# EAGLE design main (EAGLE 8.2.1)
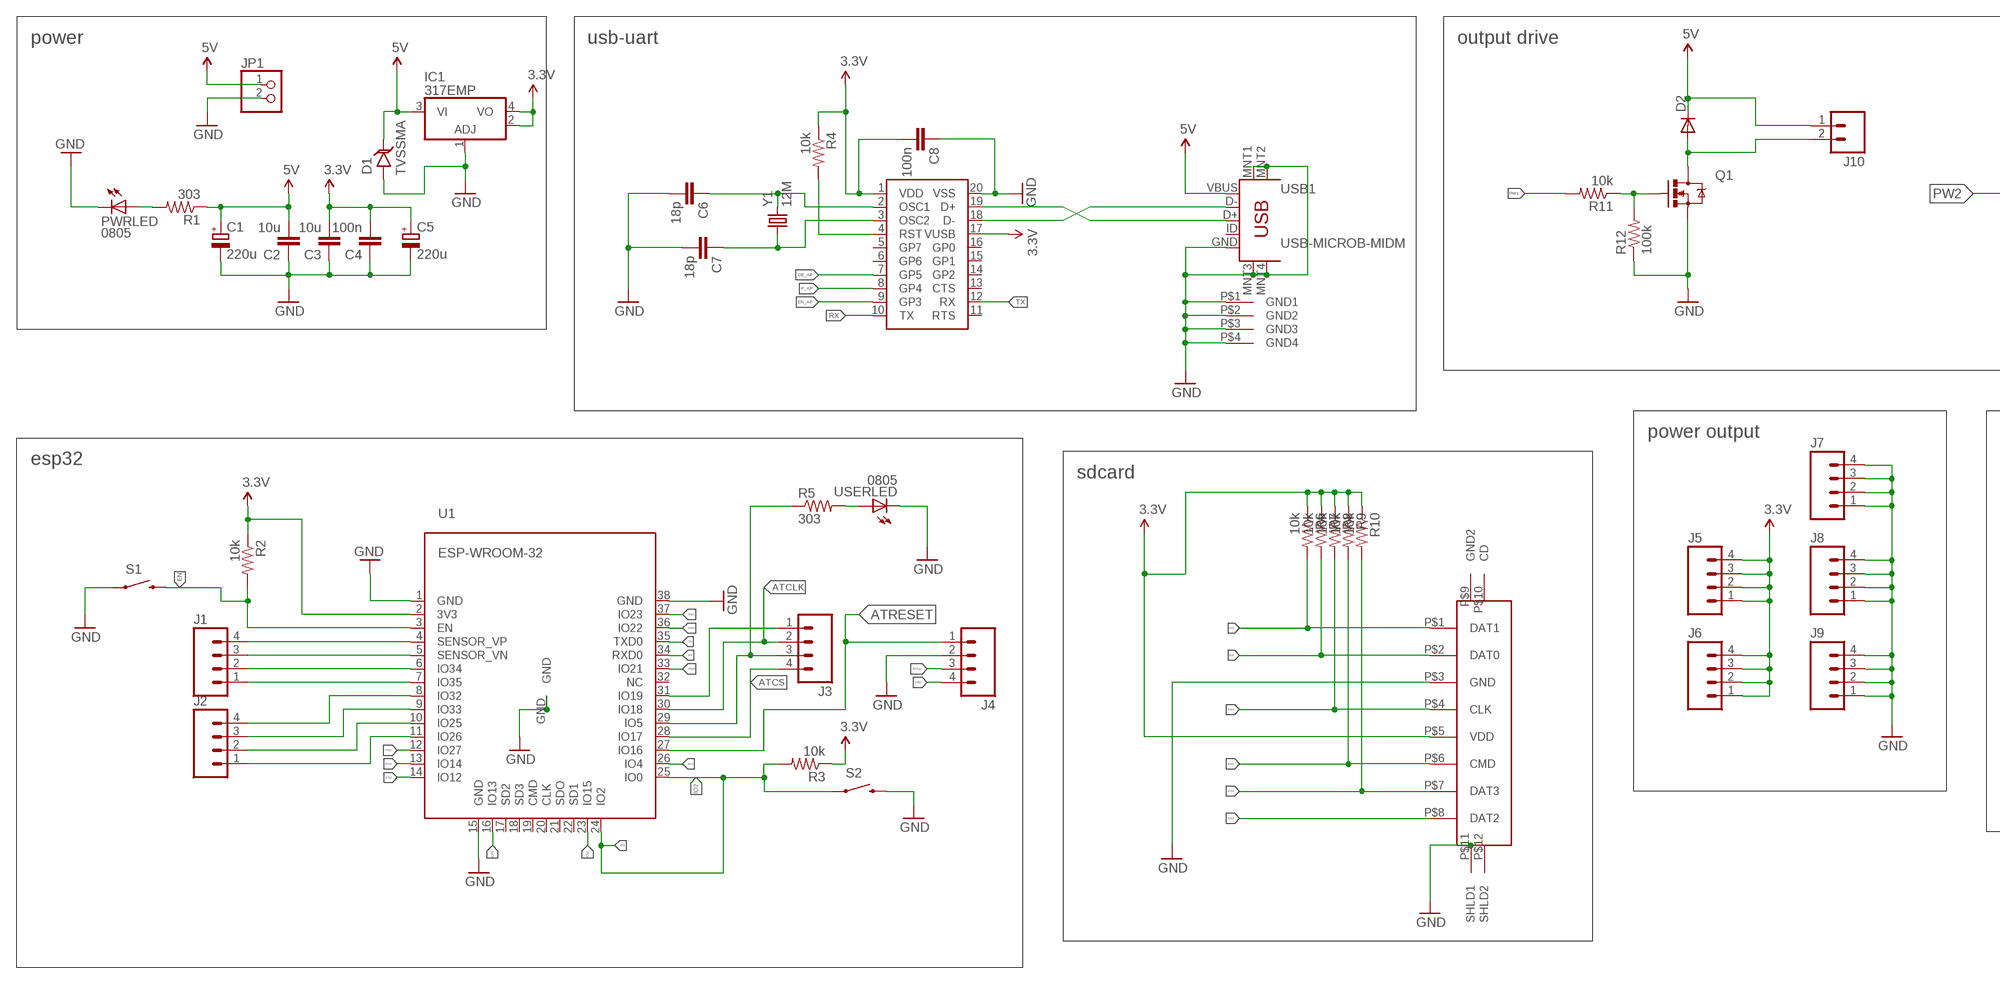
[diagram p0: schematic, sheet 1, part 1 of 2]
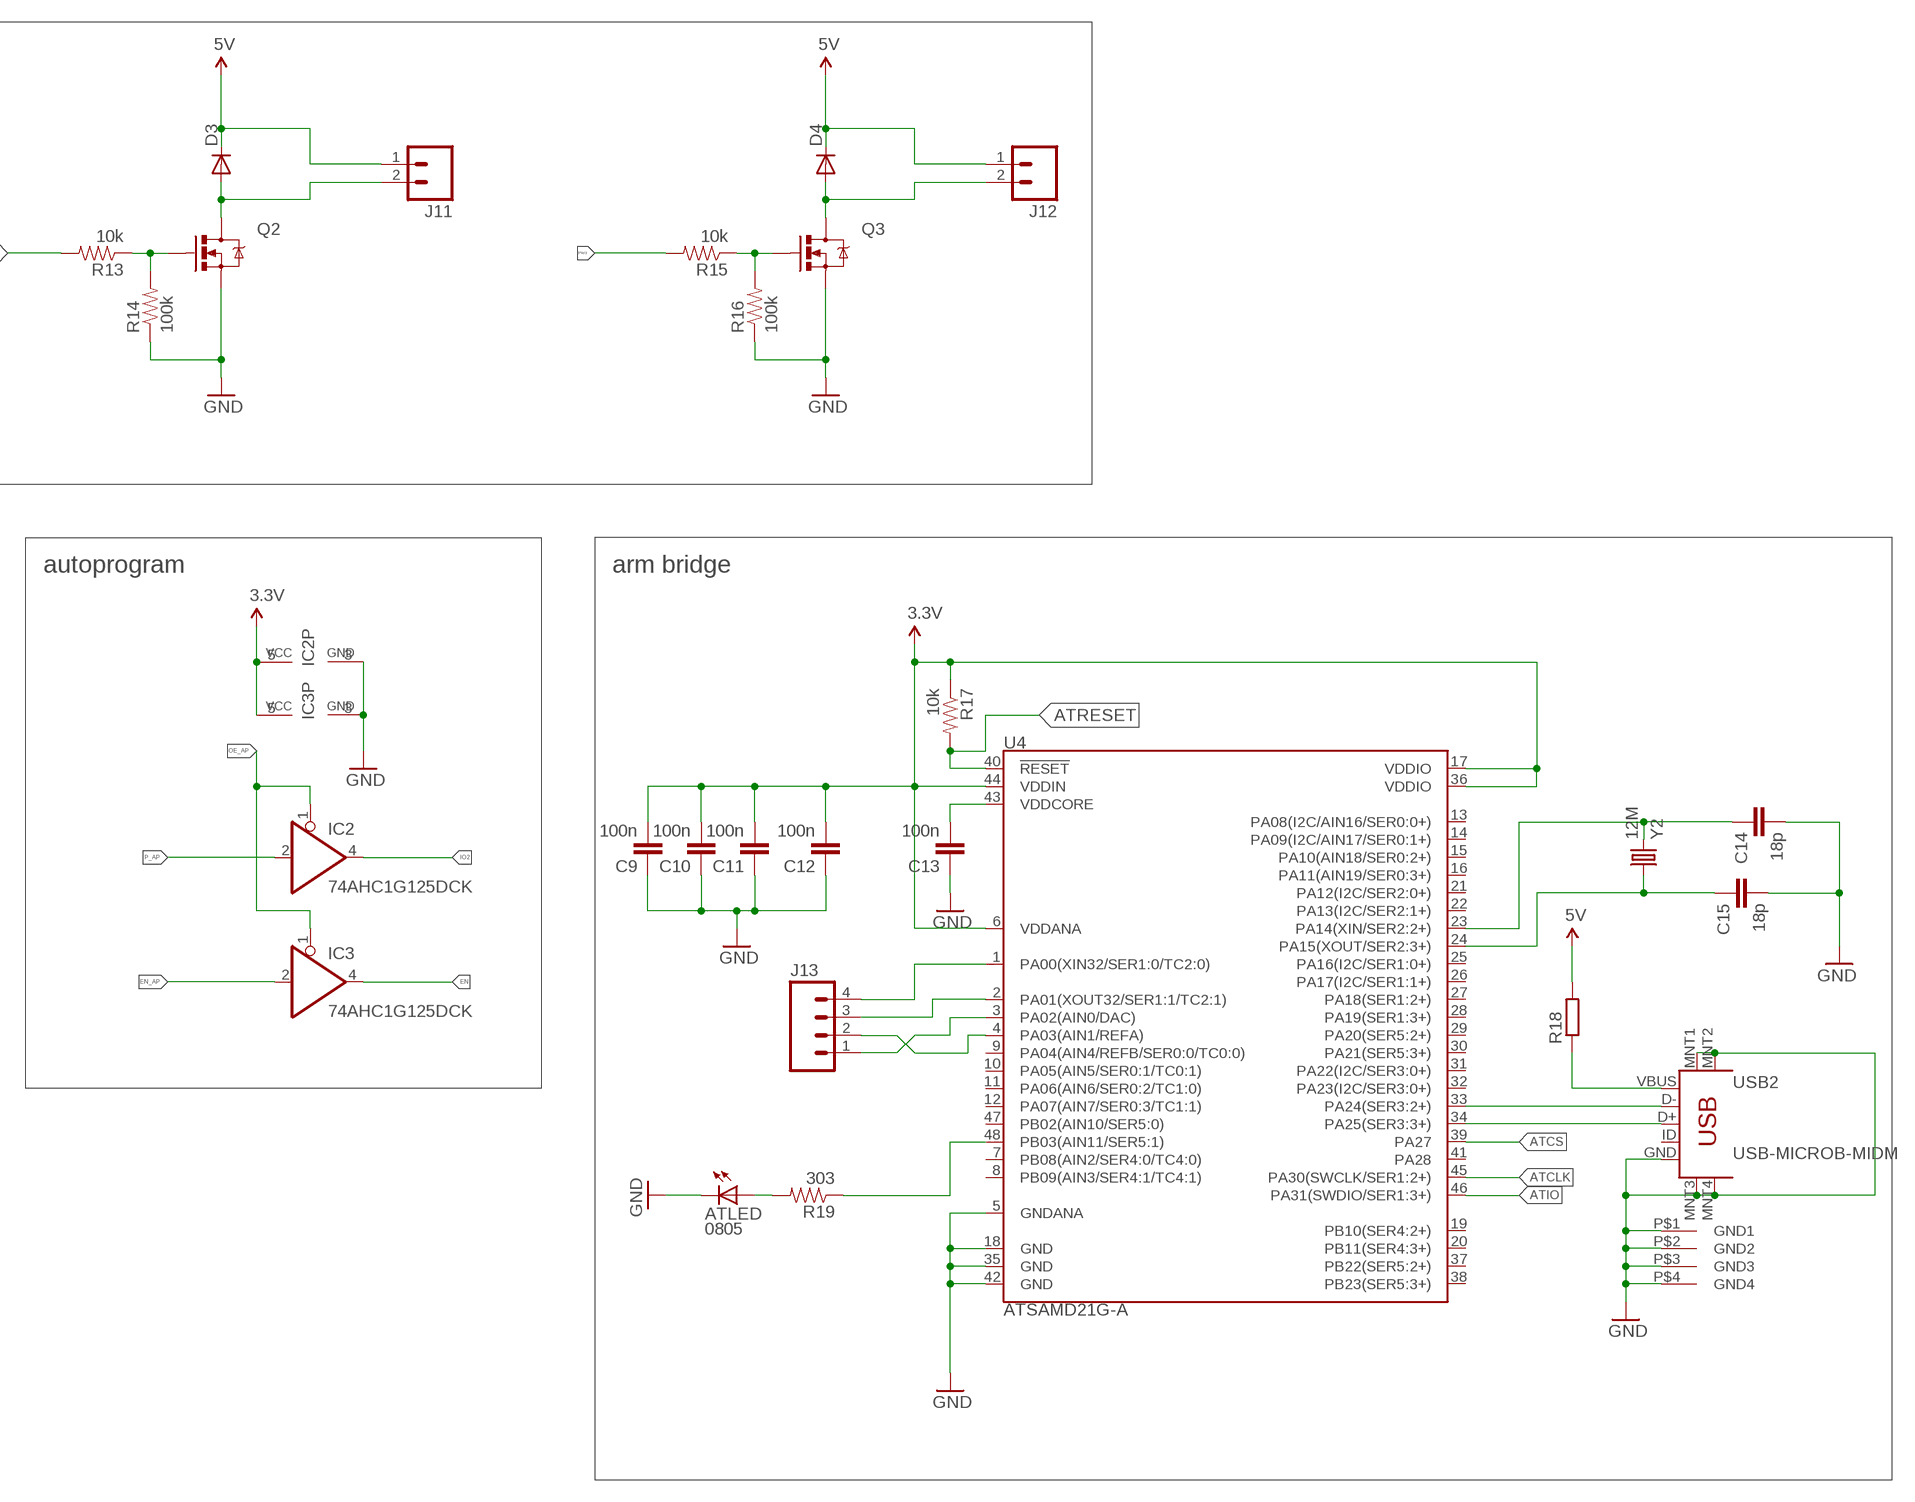
[diagram p1: schematic, sheet 1, part 2 of 2]

## Parts
ATLED  0805  LEDSML0805  [SML0805]
C1  220u  CPOL-EUE2-4  [E2-4]
C2  10u  CAP0805  [0805]
C3  10u  CAP0805  [0805]
C4  100n  CAP0603-CAP  [0603-CAP]
C5  220u  CPOL-EUE2-4  [E2-4]
C6  18p  CAP0603-CAP  [0603-CAP]
C7  18p  CAP0603-CAP  [0603-CAP]
C8  100n  CAP0603-CAP  [0603-CAP]
C9  100n  C-EUC0603K  [C0603K]
C10  100n  C-EUC0603K  [C0603K]
C11  100n  C-EUC0603K  [C0603K]
C12  100n  C-EUC0603K  [C0603K]
C13  100n  C-EUC0603K  [C0603K]
C14  18p  CAP0603-CAP  [0603-CAP]
C15  18p  CAP0603-CAP  [0603-CAP]
D1  TVSSMA  [SMA-DIODE]
D2  DIODE-SOD323-W  [SOD323-W]
D3  DIODE-SOD323-W  [SOD323-W]
D4  DIODE-SOD323-W  [SOD323-W]
IC1  317EMP  [SOT223]
IC2  74AHC1G125DCK  [SC70-5]
IC3  74AHC1G125DCK  [SC70-5]
J1  M04LONGPADS  [1X04_LONGPADS]
J2  M04LONGPADS  [1X04_LONGPADS]
J3  M041.27MM  [1X04-1.27MM]
J4  M041.27MM  [1X04-1.27MM]
J5  M04LONGPADS  [1X04_LONGPADS]
J6  M04LONGPADS  [1X04_LONGPADS]
J7  M04LONGPADS  [1X04_LONGPADS]
J8  M04LONGPADS  [1X04_LONGPADS]
J9  M04LONGPADS  [1X04_LONGPADS]
J10  M02LOCK_LONGPADS  [1X02_LOCK_LONGPADS]
J11  M02LOCK_LONGPADS  [1X02_LOCK_LONGPADS]
J12  M02LOCK_LONGPADS  [1X02_LOCK_LONGPADS]
J13  M041.27MM  [1X04-1.27MM]
JP1  PINHD-1X2  [1X02]
PWRLED  0805  LEDSML0805  [SML0805]
Q1  MOSFET-NCHANNELBSS138  [SOT23-3]
Q2  MOSFET-NCHANNELBSS138  [SOT23-3]
Q3  MOSFET-NCHANNELBSS138  [SOT23-3]
R1  303  RESISTOR0805-RES  [0805]
R2  10k  RESISTOR0805-RES  [0805]
R3  10k  RESISTOR0805-RES  [0805]
R4  10k  RESISTOR0805-RES  [0805]
R5  303  RESISTOR0805-RES  [0805]
R6  10k  RESISTOR0805-RES  [0805]
R7  10k  RESISTOR0805-RES  [0805]
R8  10k  RESISTOR0805-RES  [0805]
R9  10k  RESISTOR0805-RES  [0805]
R10  10k  RESISTOR0805-RES  [0805]
R11  10k  RESISTOR0805-RES  [0805]
R12  100k  RESISTOR0805-RES  [0805]
R13  10k  RESISTOR0805-RES  [0805]
R14  100k  RESISTOR0805-RES  [0805]
R15  10k  RESISTOR0805-RES  [0805]
R16  100k  RESISTOR0805-RES  [0805]
R17  10k  RESISTOR0805-RES  [0805]
R18  R-EU_R2010W  [R2010W]
R19  303  RESISTOR0805-RES  [0805]
S1  SWITCH-MOMENTARY-2SMD  [TACTILE-SWITCH-SMD]
S2  SWITCH-MOMENTARY-2SMD  [TACTILE-SWITCH-SMD]
U1  ESP-WROOM-32  [ESP-WROOM-32]
U2  MCP2200  [SO20W]
U3  MICROSD  [MICROSD]
U4  ATSAMD21G-A  [TQFP-48]
USB1  USB-MICROB-MIDM  [USB-B-MICRO-MIDM]
USB2  USB-MICROB-MIDM  [USB-B-MICRO-MIDM]
USERLED  0805  LEDSML0805  [SML0805]
Y1  12M  CRYSTALTXC-7A  [CRYSTAL-TXC-7A]
Y2  12M  CRYSTALTXC-7A  [CRYSTAL-TXC-7A]

## Nets
3.3V [power]: C3.2 C4.2 C5.+ C8.2 C9.2 C10.2 C11.2 C12.2 IC1.2(VO2) IC1.4(VO) IC2.5(VCC) IC3.5(VCC) J5.1 J5.2 J5.3 J5.4 J6.1 J6.2 J6.3 J6.4 R2.1 R3.1 R4.1 R6.1 R7.1 R8.1 R9.1 R10.1 R17.1 U1.2(3V3) U2.1(VDD) U2.17(VUSB) U3.P$5(VDD) U4.6(VDDANA) U4.17(VDDIO) U4.36(VDDIO) U4.44(VDDIN)
5V [power]: C1.+ C2.2 D1.C D2.C D3.C D4.C IC1.3(VI) J10.1 J11.1 J12.1 JP1.1 R1.1 R18.2 USB1.VBUS
ATCLK: J3.2 J4.3 U1.30(IO18) U4.45(PA30(SWCLK/SER1:2+))
ATCS: J3.4 U1.28(IO17) U4.39(PA27)
ATIO: J4.4 U1.12(IO27) U4.46(PA31(SWDIO/SER1:3+))
ATRESET: J4.1 R17.2 U1.27(IO16) U4.40(!RESET!)
D+: U2.19(D+) USB1.D+
D-: U2.18(D-) USB1.D-
EN: IC3.4(O) R2.2 S1.3 U1.3(EN)
EN_AP: IC3.2(I) U2.9(GP3)
GND [power]: ATLED.C C1.- C2.1 C3.1 C4.1 C5.- C6.2 C7.2 C8.1 C9.1 C10.1 C11.1 C12.1 C13.1 C14.2 C15.2 D1.A IC1.1(ADJ) IC2.3(GND) IC3.3(GND) J4.2 J7.1 J7.2 J7.3 J7.4 J8.1 J8.2 J8.3 J8.4 J9.1 J9.2 J9.3 J9.4 JP1.2 PWRLED.C Q1.2(S) Q2.2(S) Q3.2(S) R12.1 R14.1 R16.1 S1.1 S2.3 U1.1(GND) U1.15(GND) U1.38(GND) U1.GND U2.20(VSS) U3.P$3(GND) U3.P$11(SHLD1) U3.P$12(SHLD2) U4.5(GNDANA) U4.18(GND) U4.35(GND) U4.42(GND) USB1.GND USB1.MNT1(MTN1) USB1.MNT2(MTN2) USB1.MNT3(MTN3) USB1.MNT4(MTN4) USB1.P$1(GND1) USB1.P$2(GND2) USB1.P$3(GND3) USB1.P$4(GND4) USB2.GND USB2.MNT1(MTN1) USB2.MNT2(MTN2) USB2.MNT3(MTN3) USB2.MNT4(MTN4) USB2.P$1(GND1) USB2.P$2(GND2) USB2.P$3(GND3) USB2.P$4(GND4) USERLED.C
IO2: IC2.4(O) R3.2 R7.2 S2.1 U1.24(IO2) U1.25(IO0) U3.P$2(DAT0)
IO4: R6.2 U1.26(IO4) U3.P$1(DAT1)
IO12: U1.14(IO12) U3.P$8(DAT2)
IO13: R10.2 U1.16(IO13) U3.P$7(DAT3)
IO14: R8.2 U1.13(IO14) U3.P$4(CLK)
IO15: R9.2 U1.23(IO15) U3.P$6(CMD)
N$1: J3.1 U1.31(IO19)
N$2: R19.1 U4.48(PB03(AIN11/SER5:1))
N$3: R5.2 USERLED.A
N$4: ATLED.A R19.2
N$5: J3.3 R5.1 U1.29(IO5)
N$6: J13.4 U4.1(PA00(XIN32/SER1:0/TC2:0))
N$7: PWRLED.A R1.2
N$8: J13.3 U4.2(PA01(XOUT32/SER1:1/TC2:1))
N$9: C13.2 U4.43(VDDCORE)
N$10: U4.33(PA24(SER3:2+)) USB2.D-
N$11: U4.34(PA25(SER3:3+)) USB2.D+
N$12: R18.1 USB2.VBUS
N$13: J13.1 U4.3(PA02(AIN0/DAC))
N$14: J13.2 U4.4(PA03(AIN1/REFA))
N$15: D2.A J10.2 Q1.3(D)
N$16: D3.A J11.2 Q2.3(D)
N$17: Q2.1(G) R13.1 R14.2
N$18: R4.2 U2.4(RST)
N$20: C15.1 U4.24(PA15(XOUT/SER2:3+)) Y2.P$1
N$21: Q1.1(G) R11.1 R12.2
N$22: C6.1 U2.2(OSC1) Y1.P$2
N$23: C7.1 U2.3(OSC2) Y1.P$1
N$24: J1.4 U1.4(SENSOR_VP)
N$25: J1.3 U1.5(SENSOR_VN)
N$26: J1.2 U1.6(IO34)
N$27: J1.1 U1.7(IO35)
N$28: J2.4 U1.8(IO32)
N$29: J2.3 U1.9(IO33)
N$30: J2.2 U1.10(IO25)
N$31: J2.1 U1.11(IO26)
N$32: D4.A J12.2 Q3.3(D)
N$33: Q3.1(G) R15.1 R16.2
N$34: C14.1 U4.23(PA14(XIN/SER2:2+)) Y2.P$2
OE_AP: IC2.1(OE) IC3.1(OE) U2.7(GP5)
P_AP: IC2.2(I) U2.8(GP4)
PW1: R11.2 U1.37(IO23)
PW2: R13.2 U1.36(IO22)
PW3: R15.2 U1.33(IO21)
RX: U1.34(RXD0) U2.10(TX)
TX: U1.35(TXD0) U2.12(RX)
Unconnected: U1.17(SD2) U1.18(SD3) U1.19(CMD) U1.20(CLK) U1.21(SDO) U1.22(SD1) U1.32(NC) U2.5(GP7) U2.6(GP6) U2.11(RTS) U2.13(CTS) U2.14(GP2) U2.15(GP1) U2.16(GP0) U3.P$9(GND2) U3.P$10(CD) U4.7(PB08(AIN2/SER4:0/TC4:0)) U4.8(PB09(AIN3/SER4:1/TC4:1)) U4.9(PA04(AIN4/REFB/SER0:0/TC0:0)) U4.10(PA05(AIN5/SER0:1/TC0:1)) U4.11(PA06(AIN6/SER0:2/TC1:0)) U4.12(PA07(AIN7/SER0:3/TC1:1)) U4.13(PA08(I2C/AIN16/SER0:0+)) U4.14(PA09(I2C/AIN17/SER0:1+)) U4.15(PA10(AIN18/SER0:2+)) U4.16(PA11(AIN19/SER0:3+)) U4.19(PB10(SER4:2+)) U4.20(PB11(SER4:3+)) U4.21(PA12(I2C/SER2:0+)) U4.22(PA13(I2C/SER2:1+)) U4.25(PA16(I2C/SER1:0+)) U4.26(PA17(I2C/SER1:1+)) U4.27(PA18(SER1:2+)) U4.28(PA19(SER1:3+)) U4.29(PA20(SER5:2+)) U4.30(PA21(SER5:3+)) U4.31(PA22(I2C/SER3:0+)) U4.32(PA23(I2C/SER3:0+)) U4.37(PB22(SER5:2+)) U4.38(PB23(SER5:3+)) U4.41(PA28) U4.47(PB02(AIN10/SER5:0)) USB1.ID USB2.ID

## Notes on the sheet
- power | usb-uart | output drive
- power output | autoprogram | arm bridge
- esp32
- sdcard

## Library data of the parts
ATLED PWRLED USERLED = led:LED: LED OSRAM: - CHIPLED LG R971, LG N971, LY N971, LG Q971, LY Q971, LO R971, LY R971 LH N974, LH R974 LS Q976, LO Q976, LY Q976 LO Q996 - Hyper CHIPLED LW Q18S LB Q993, LB Q99A, LB R99A - SideLED LS A670, LO A670, LY A670, LG A670, LP A670 LB A673, LV A673, LT A673, LW A673 LH A674 LY A675 LS A676, LA A676, LO A676, LY A676, LW A676 LS A679, LY A679, LG A679 - Hyper Micro SIDELED® LS Y876, LA Y876, LO Y876, LY Y876 LT Y87S - SmartLED LW L88C, LW L88S LB L89C, LB L89S, LG L890 LS L89K, LO L89K, LY L89K LS L896, LA L896, LO L896, LY L896 - TOPLED LS T670, LO T670, LY T670, LG T670, LP T670 LSG T670, LSP T670, LSY T670, LOP T670, LYG T670 LG T671, LOG T671, LSG T671 LB T673, LV T673, LT T673, LW T673 LH T674 LS T676, LA T676, LO T676, LY T676, LB T676, LH T676, LSB T676, LW T676 LB T67C, LV T67C, LT T67C, LS T67K, LO T67K, LY T67K, LW E67C LS E67B, LA E67B, LO E67B, LY E67B, LB E67C, LV E67C, LT E67C LW T67C LS T679, LY T679, LG T679 LS T770, LO T770, LY T770, LG T770, LP T770 LB T773, LV T773, LT T773, LW T773 LH T774 LS E675, LA E675, LY E675, LS T675 LS T776, LA T776, LO T776, LY T776, LB T776 LHGB T686 LT T68C, LB T68C - Hyper Mini TOPLED® LB M676 - Mini TOPLED Santana® LG M470 LS M47K, LO M47K, LY M47K Source: http://www.osram.convergy.de LUXEON: - LUMILED® LXK2-PW12-R00, LXK2-PW12-S00, LXK2-PW14-U00, LXK2-PW14-V00 LXK2-PM12-R00, LXK2-PM12-S00, LXK2-PM14-U00 LXK2-PE12-Q00, LXK2-PE12-R00, LXK2-PE12-S00, LXK2-PE14-T00, LXK2-PE14-U00 LXK2-PB12-K00, LXK2-PB12-L00, LXK2-PB12-M00, LXK2-PB14-N00, LXK2-PB14-P00, LXK2-PB14-Q00 LXK2-PR12-L00, LXK2-PR12-M00, LXK2-PR14-Q00, LXK2-PR14-R00 LXK2-PD12-Q00, LXK2-PD12-R00, LXK2-PD12-S00 LXK2-PH12-R00, LXK2-PH12-S00 LXK2-PL12-P00, LXK2-PL12-Q00, LXK2-PL12-R00 Source: www.luxeon.com KINGBRIGHT: KA-3528ASYC Source: www.kingbright.com
C1 C5 = rcl:CPOL-EU: POLARIZED CAPACITOR, European symbol
C2-C4 C6-C8 C14 C15 = SparkFun-Capacitors:CAP: Capacitor Standard 0603 ceramic capacitor, and 0.1" leaded capacitor.
C9-C13 = resistor:C-EU: CAPACITOR, European symbol
D1 = SparkFun-DiscreteSemi:TVS: Transient voltage suppressor- prevents ESD on inputs.
D2-D4 = diode:DIODE-: DIODE
IC1 = linear:*317: Positive VOLTAGE REGULATOR
IC2 IC3 = 74xx-little-de:74*1G125: Single Bus Buffer Gate with 3-State Output
J1 J2 J5-J9 = SparkFun-Connectors:M04: Header 4 Standard 4-pin 0.1" header. Use with straight break away headers (SKU : PRT-00116), right angle break away headers (PRT-00553), swiss pins (PRT-00743), machine pins (PRT-00117), and female headers (PRT-00115). Molex polarized connector foot print use with SKU : PRT-08231 with associated crimp pins and housings. 1MM SMD Version SKU: PRT-10208; PROD_ID: CONN-09696
J3 J4 J13 = SparkFun-Connectors:M04: Header 4 Standard 4-pin 0.1" header. Use with straight break away headers (SKU : PRT-00116), right angle break away headers (PRT-00553), swiss pins (PRT-00743), machine pins (PRT-00117), and female headers (PRT-00115). Molex polarized connector foot print use with SKU : PRT-08231 with associated crimp pins and housings. 1MM SMD Version SKU: PRT-10208
J10-J12 = SparkFun-Connectors:M02: Standard 2-pin 0.1" header. Use with - straight break away headers ( PRT-00116) - right angle break away headers (PRT-00553) - swiss pins (PRT-00743) - machine pins (PRT-00117) - female headers (PRT-00115) Molex polarized connector foot print use with: PRT-08233 with associated crimp pins and housings. 2.54_SCREWTERM for use with PRT-10571. 3.5mm Screw Terminal footprints for PRT-08084 5mm Screw Terminal footprints for use with PRT-08432
JP1 = pinhead:PINHD-1X2: PIN HEADER
Q1-Q3 = SparkFun-DiscreteSemi:MOSFET-NCHANNEL: Common NMOSFET Parts MFG P/N Store ID Prod ID FDD8780 TRANS-09984 SI7820DN TRANS-11055 FDS6630A IC-08089 2N7002PW TRANS-11151 FQP30N06L COM-10213 TRANS-10060 BSS123LT1G TRANS-08345 BSS138 TRANS-00830 BS170 2N7000; PROD_ID: TRANS-00830; VALUE: 200mA/50V
R1-R17 R19 = SparkFun-Resistors:RESISTOR: Resistor Basic schematic elements and footprints for 0603, 1206, and PTH resistors.
R18 = resistor:R-EU_: RESISTOR, European symbol
S1 S2 = SparkFun-Electromechanical:SWITCH-MOMENTARY-2: Various NO switches- pushbuttons, reed, etc; PROD_ID: SWCH-08247
U1 = esp32:ESP-WROOM-32
U2 = microusb:MCP2200
U3 = avrboard-addons:MICROSD
U4 = samd21-temp:ATSAMD21G: Atmel SAMD21G SMART ARM-Based Microcontroller The Atmel ® | SMART ™ SAM D21 is a series of low-power microcontrollers using the 32-bit ARM ® Cortex ® -M0+ processor, and ranging from 32- to 64-pins with up to 256KB Flash and 32KB of SRAM. The SAM D21 devices operate at a maximum frequency of 48MHz and reach 2.46 CoreMark/MHz. They are designed for simple and intuitive migration with identical peripheral modules, hex compatible code, identical linear address map and pin compatible migration paths between all devices in the product series. All devices include intelligent and flexible peripherals, Atmel Event System for inter-peripheral signaling, and support for capacitive touch button, slider and wheel user interfaces.; PROD_ID: IC-13064
USB1 USB2 = microusb:USB-MICROB-MIDM
Y1 Y2 = SparkFun-FreqCtrl:CRYSTAL: Various standard crystals. Proven footprints.

## Net classes
0 default: width 0.254 mm, drill 0.4 mm, clearance 0.152 mm
1 power: width 0.254 mm, drill 0.6 mm, clearance 0.203 mm

## Board
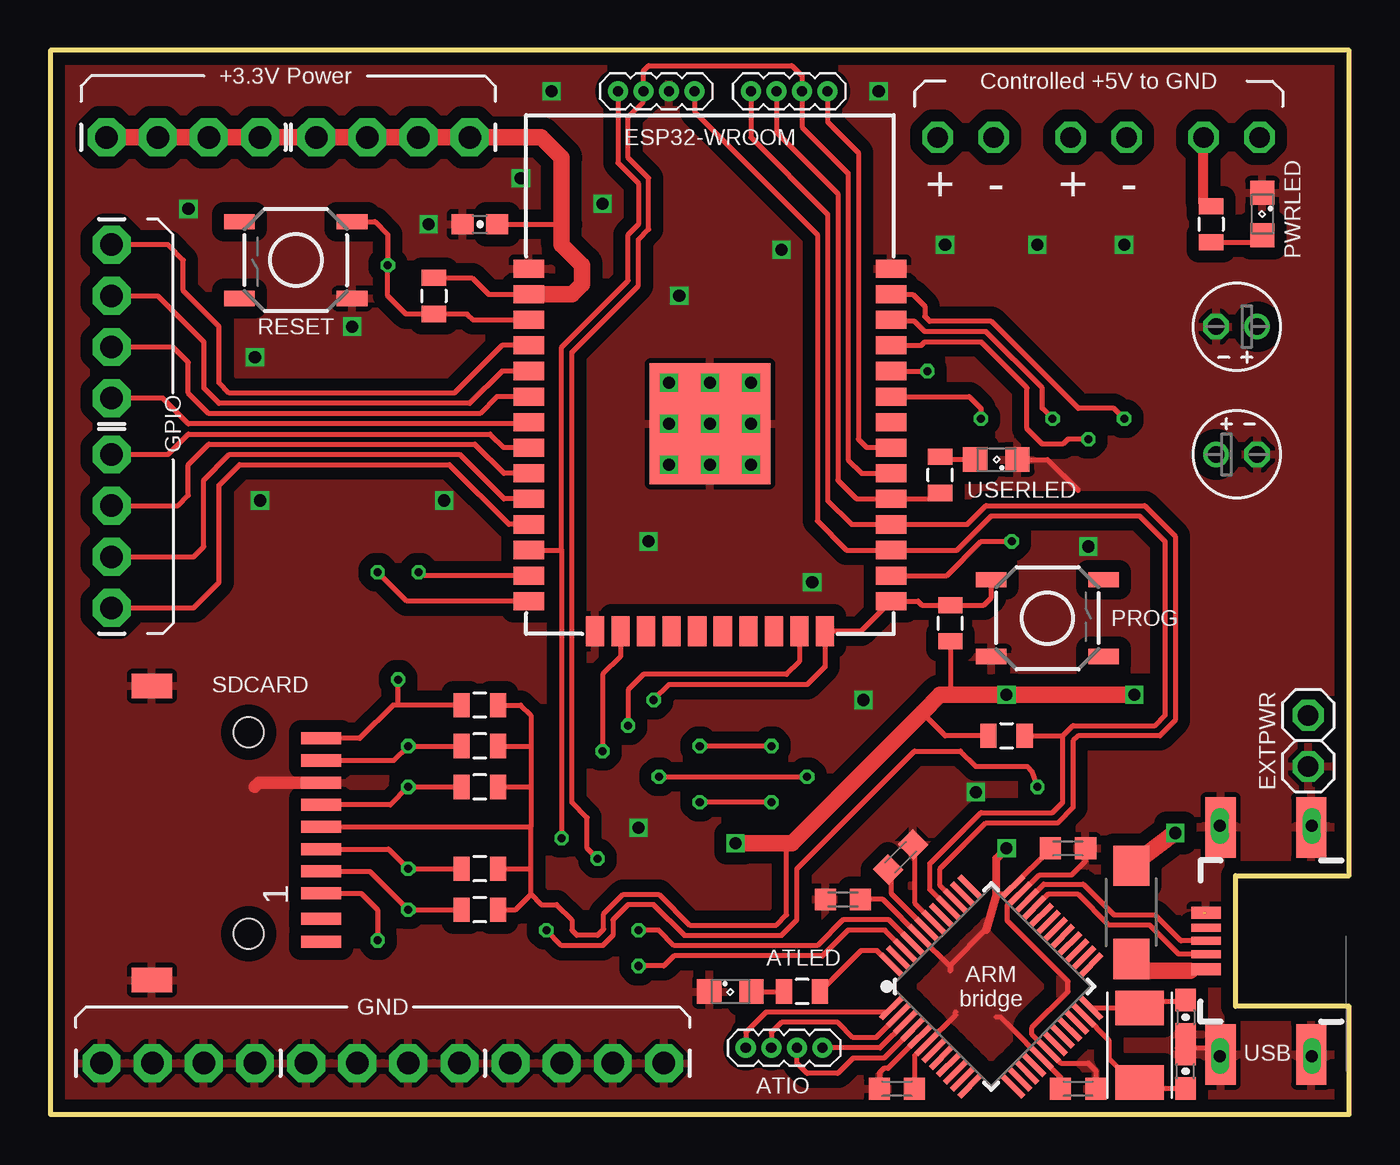
[diagram p2: board, top side]
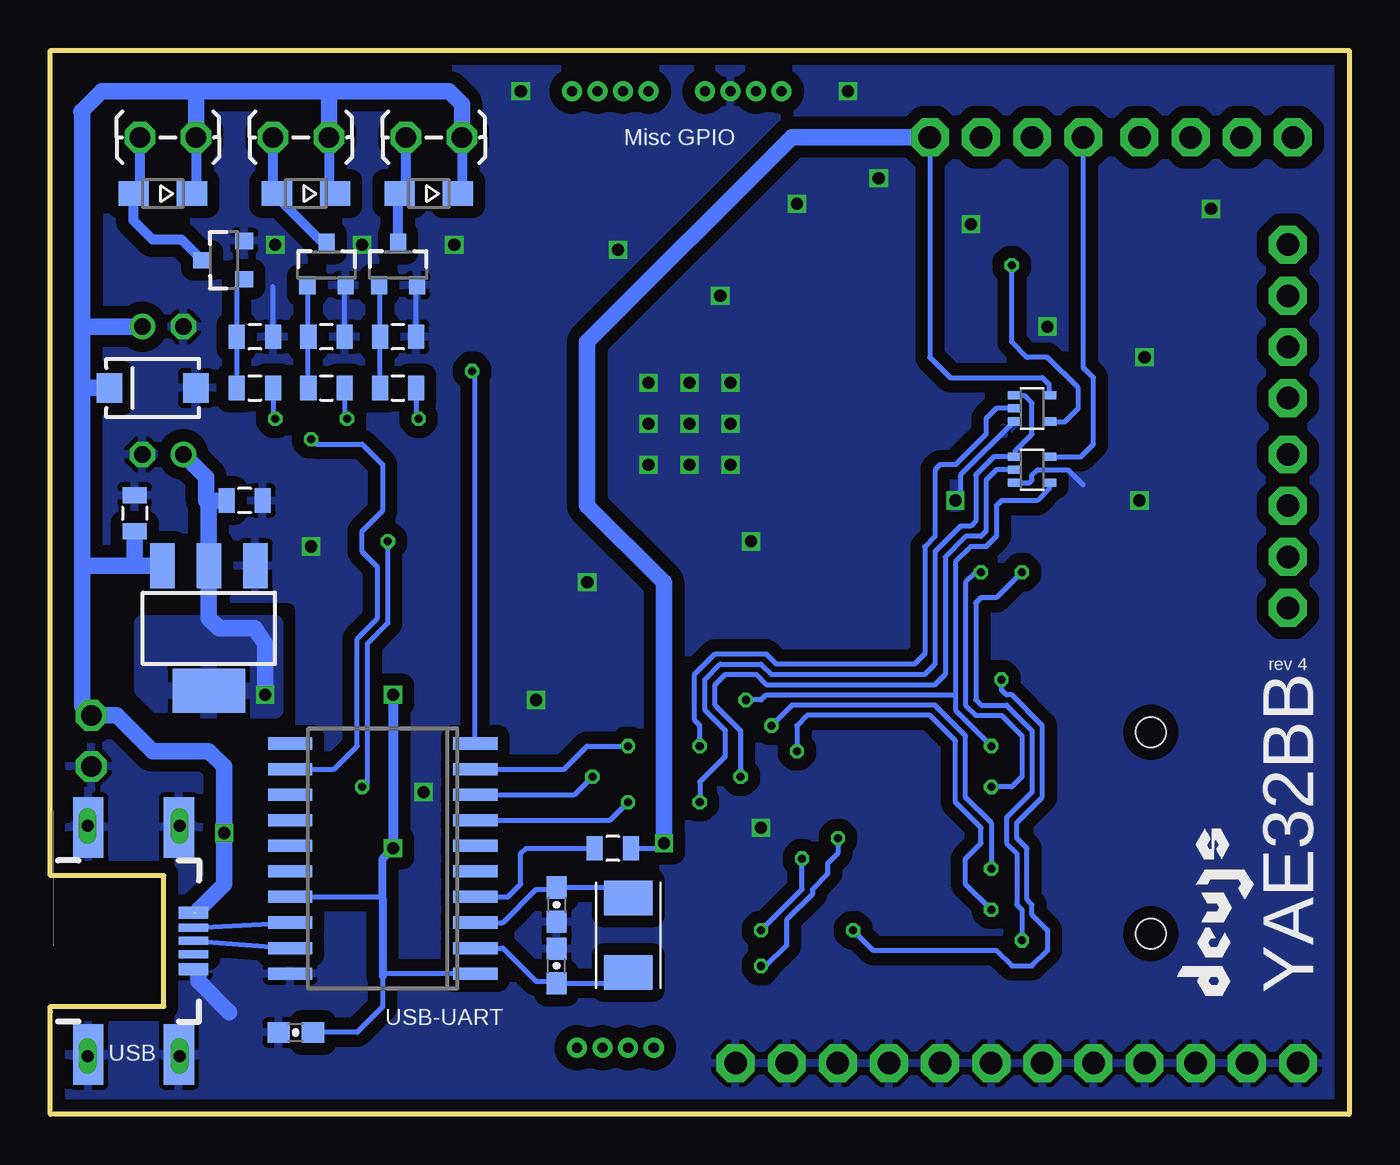
[diagram p3: board, bottom side, seen from below]

Size 64.52 x 52.83 mm. Coordinates in mm from the lower left corner, seen from the top.
Outline: 0,0 64.52,0 64.52,5.08 64.52,5.08 64.52,5.36 58.88,5.36 58.88,11.85 64.52,11.85 64.52,52.83 0,52.83 0,0
Copper layers (1*16): Top 0.035mm / dielectric 1.6mm / Bottom 0.035mm
Design rules "Elecrow_2-layer_PCB_eagle_rule": minimum track width 6mil, minimum drill 12mil, track to track 6mil, track to pad 6mil, pad to pad 6mil, via to via 8mil, smd to smd 0mil, copper to edge 20mil, drill to drill 10mil, minimum pad ring 6mil, minimum via ring 6mil, stop-mask expansion 0mil, vias tented up to drill 100mil, thermal gap 10mil

### Footprints (pad centres in the part's own frame; a part is rotated, then mirrored left to right if it is on the bottom)
SML0805 = smd 1.2 x 1.2: A 1.05,0; C -1.05,0
E2-4 = drill 0.813 pad 1.27: + -1.016,0 | drill 0.813 pad 1.27 octagon: - 1.016,0
0805 = smd 0.8 x 1.2: 1 -0.9,0; 2 0.9,0
0603-CAP = smd 1.1 x 1: 1 -0.85,0; 2 0.85,0
C0603K = smd 1.05 x 1.08: 1 -0.875,0; 2 0.875,0
SMA-DIODE = smd 1.27 x 1.47: A -2.15,0; C 2.15,0
SOD323-W = smd 1.5 x 1.2: A 1.45,0; C -1.45,0
SOT223 = smd 1.219 x 2.235: 1 -2.311,-3.099; 2 0,-3.099; 3 2.311,-3.099 | smd 3.6 x 2.2: 4 0,3.099
SC70-5 = smd 0.4 x 0.7: 1 -0.65,-0.85; 2 0,-0.85; 3 0.65,-0.85; 4 0.65,0.85; 5 -0.65,0.85
1X04_LONGPADS = drill 1.118 pad 1.88 octagon: 1 0,0; 2 2.54,0; 3 5.08,0; 4 7.62,0
1X04-1.27MM = drill 0.508 pad 1: 1 0,0; 2 1.27,0; 3 2.54,0; 4 3.81,0
1X02_LOCK_LONGPADS = drill 1.016 octagon: 1 -0.127,0; 2 2.667,0
1X02 = drill 1.016 octagon: 1 -1.27,0; 2 1.27,0
SOT23-3 = smd 0.8 x 0.9: 1 -0.95,-1; 2 0.95,-1; 3 0,1.1
R2010W = smd 2 x 1.8: 1 -2.311,0; 2 2.311,0
TACTILE-SWITCH-SMD = smd 1.524 x 0.762: 1 -2.794,1.905; 2 2.794,1.905; 3 -2.794,-1.905; 4 2.794,-1.905
ESP-WROOM-32 = smd 0.9 x 1.5: 1 7.7,9; 2 6.43,9; 3 5.16,9; 4 3.89,9; 5 2.62,9; 6 1.35,9; 7 0.08,9; 8 -1.19,9; 9 -2.46,9; 10 -3.73,9; 11 -5,9; 12 -6.27,9; 13 -7.54,9; 14 -8.81,9; 25 -8.81,-9; 26 -7.54,-9; 27 -6.27,-9; 28 -5,-9; 29 -3.73,-9; 30 -2.46,-9; 31 -1.19,-9; 32 0.08,-9; 33 1.35,-9; 34 2.62,-9; 35 3.89,-9; 36 5.16,-9; 37 6.43,-9; 38 7.7,-9 | smd 1.5 x 0.9: 15 -10.3,5.715; 16 -10.3,4.445; 17 -10.3,3.175; 18 -10.3,1.905; 19 -10.3,0.635; 20 -10.3,-0.635; 21 -10.3,-1.905; 22 -10.3,-3.175; 23 -10.3,-4.445; 24 -10.3,-5.715 | smd 6 x 6: GND 0,0
SO20W = smd 0.6 x 2.2: 1 -5.715,-4.6; 2 -4.445,-4.6; 3 -3.175,-4.6; 4 -1.905,-4.6; 5 -0.635,-4.6; 6 0.635,-4.6; 7 1.905,-4.6; 8 3.175,-4.6; 9 4.445,-4.6; 10 5.715,-4.6; 11 5.715,4.6; 12 4.445,4.6; 13 3.175,4.6; 14 1.905,4.6; 15 0.635,4.6; 16 -0.635,4.6; 17 -1.905,4.6; 18 -3.175,4.6; 19 -4.445,4.6; 20 -5.715,4.6
MICROSD = smd 0.6 x 2: P$1 -4.7,1; P$2 -3.6,1; P$3 -2.5,1; P$4 -1.4,1; P$5 -0.3,1; P$6 0.8,1; P$7 1.9,1; P$8 3,1; P$9 4.25,1; P$10 5.4,1 | smd 1.2 x 2: P$11 7.3,-7.4; P$12 -7.3,-7.4 | hole 1.5: -5,-2.6; 5,-2.6
TQFP-48 = smd 1.5 x 0.28: 1 -4.25,2.75; 2 -4.25,2.25; 3 -4.25,1.75; 4 -4.25,1.25; 5 -4.25,0.75; 6 -4.25,0.25; 7 -4.25,-0.25; 8 -4.25,-0.75; 9 -4.25,-1.25; 10 -4.25,-1.75; 11 -4.25,-2.25; 12 -4.25,-2.75; 25 4.25,-2.75; 26 4.25,-2.25; 27 4.25,-1.75; 28 4.25,-1.25; 29 4.25,-0.75; 30 4.25,-0.25; 31 4.25,0.25; 32 4.25,0.75; 33 4.25,1.25; 34 4.25,1.75; 35 4.25,2.25; 36 4.25,2.75 | smd 0.28 x 1.5: 13 -2.75,-4.25; 14 -2.25,-4.25; 15 -1.75,-4.25; 16 -1.25,-4.25; 17 -0.75,-4.25; 18 -0.25,-4.25; 19 0.25,-4.25; 20 0.75,-4.25; 21 1.25,-4.25; 22 1.75,-4.25; 23 2.25,-4.25; 24 2.75,-4.25; 37 2.75,4.25; 38 2.25,4.25; 39 1.75,4.25; 40 1.25,4.25; 41 0.75,4.25; 42 0.25,4.25; 43 -0.25,4.25; 44 -0.75,4.25; 45 -1.25,4.25; 46 -1.75,4.25; 47 -2.25,4.25; 48 -2.75,4.25
USB-B-MICRO-MIDM = smd 1.45 x 0.4: D+ 2.725,0; D- 2.725,0.65; ID 2.725,-0.65 | smd 1.45 x 0.6: GND 2.725,-1.4; VBUS 2.725,1.4 | smd 1.5 x 3: MNT1 -2.5,-5.635; MNT2 2,-5.635; MNT3 -2.5,5.635; MNT4 2,5.635 | drill 0.6 long: P$1 -2.54,5.715; P$2 2.032,5.715; P$3 -2.54,-5.715; P$4 2.032,-5.715
CRYSTAL-TXC-7A = smd 1.7 x 2.4: P$1 1.85,0; P$2 -1.85,0

### Placement (x,y rotation side)
ATLED  33.78,6.1 0 top
C1  58.93,39.12 180 top
C2  60.33,29.84 270 bottom
C3  54.86,30.48 180 bottom
C4  52.32,4.06 0 bottom
C5  58.93,32.77 0 top
C6  39.37,7.37 90 bottom
C7  39.37,10.41 270 bottom
C8  21.34,44.2 0 top
C9  42.05,1.27 0 top
C10  50.55,13.21 180 top
C11  39.37,10.67 0 top
C12  51.05,1.27 180 top
C13  42.24,12.77 225 top
C14  56.39,2.13 90 top
C15  56.39,4.83 270 top
D1  59.44,36.07 180 bottom
D2  58.93,45.72 180 bottom
D3  51.82,45.72 180 bottom
D4  45.72,45.72 180 bottom
IC1  56.64,24.13 180 bottom
IC2  15.75,32 270 bottom
IC3  15.75,35.05 270 bottom
J1  3.05,35.56 90 top
J2  3.05,25.15 90 top
J3  38.61,50.8 180 top
J4  32,50.8 180 top
J5  13.21,48.51 0 top
J6  2.79,48.51 0 top
J7  22.86,2.54 0 top
J8  12.7,2.54 0 top
J9  2.54,2.54 0 top
J10  57.4,48.51 180 bottom
J11  50.8,48.51 180 bottom
J12  44.2,48.51 180 bottom
J13  38.35,3.3 180 top
JP1  62.48,18.54 270 top
PWRLED  60.2,44.7 270 top
Q1  55.88,42.42 90 bottom
Q2  50.8,42.16 0 bottom
Q3  47.24,42.16 0 bottom
R1  57.66,44.2 270 top
R2  19.05,40.64 270 top
R3  44.7,24.38 90 top
R4  36.58,13.21 180 bottom
R5  44.2,31.75 90 top
R6  21.34,20.32 180 top
R7  21.34,18.29 180 top
R8  21.34,16.26 180 top
R9  21.34,12.19 180 top
R10  21.34,10.16 180 top
R11  54.36,36.07 0 bottom
R12  54.36,38.61 180 bottom
R13  50.8,36.07 0 bottom
R14  50.8,38.61 180 bottom
R15  47.24,36.07 0 bottom
R16  47.24,38.61 180 bottom
R17  47.5,18.8 0 top
R18  53.69,10.03 90 top
R19  37.34,6.1 180 top
S1  12.19,42.42 180 top
S2  49.53,24.64 0 top
U1  32.77,34.29 90 top
U2  48.01,12.7 90 bottom
U3  12.45,13.97 270 top
U4  46.74,6.35 45 top
U$2  [DEVJS]  4.06,5.59 90 bottom
USB1  60.13,8.61 0 bottom
USB2  60.13,8.61 180 top
USERLED  46.99,32.51 180 top
Y1  35.81,8.89 90 bottom
Y2  54.1,3.44 90 top

### Tracks (layer width: path | path; a pad name or v marks a point on that pad's centre or on a via)
3.3V  (via drill 0.6)
  Top 0.254: U3.P$5 23.88,14.27 | R6.1 23.37,20.32 23.88,19.81 23.88,18.29 | 23.88,18.29 23.88,16.26 | 23.88,16.26 23.88,14.27 | 23.88,12.19 23.88,14.27 | R9.1 23.88,12.19 | R8.1 23.88,16.26 | R7.1 23.88,18.29 | U1.2 21.76,40.72 20.94,41.54 R2.1 | C8.2 25.4,44.2 | 44.82,23.37 R3.1 44.7,20.83 | 52.72,20.69 52.58,20.83 | R17.1 44.45,18.8 43.31,19.94 | U4.36 48.01,11.51 | C11.2 41.36,10.67 U4.44 44.7,7.32 44.7,7.11 44.7,7.41 46.5,9.21 | C9.2 42.93,2.89 U4.6 44.96,4.93 44.96,5.08 | C12.2 50.18,1.85 U4.17 47.75,4.27 | 47.75,4.27 47.75,4.32 | U4.36 47.42,10.92 46.99,10.92 | R10.1 23.11,10.16 23.88,10.92 | 23.88,10.92 23.88,12.19 | 36.83,13.46 36.58,13.21 36.58,9.91 36.07,9.4 31.75,9.4 30.23,10.92 28.45,10.92 27.48,9.96 27.48,9.2 27.18,8.89 26.16,8.89 25.91,9.14 25.91,9.65 25.15,10.41 24.38,10.41 23.88,10.92 | C10.2 49.67,13.17 U4.36 | 47.75,4.27 47.2,4.83 46.99,4.83
  Top 0.406: v47.5,13.21 46.99,12.7 46.99,10.92 46.5,9.21 46.48,9.14
  Top 0.813: v34.04,13.46 36.83,13.46 43.31,19.94 44.2,20.83 44.7,20.83 v47.5,20.83 52.58,20.83 v53.85,20.83 | U1.2 25.91,40.72 26.42,41.23 26.42,42.16 25.4,43.18 25.4,44.2 25.4,47.5 24.38,48.51 J5.4 J5.3 J5.2 J5.1 J6.4 J6.3 J6.2 J6.1
  Bottom 0.254: 20.83,49.28 J5.4 20.83,37.59 19.81,36.58 15.24,36.58 14.9,36.23 IC3.5 15.1,35.7 | C4.2 49.28,4.06 48.01,5.33 48.01,6.86 47.88,6.99 U2.1 | U2.17 48.13,10.79 48.01,10.67 | J5.1 13.21,37.08 12.7,36.58 12.7,33.27 13.32,32.65 IC2.5 14.99,32.74 | R4.1 34.29,13.21 v34.04,13.46
  Bottom 0.406: v47.5,13.21 48.01,12.7 48.01,10.67 48.01,6.86
  Bottom 0.508: v47.5,20.83 v47.5,13.21
  Bottom 0.813: J5.4 27.69,48.51 37.85,38.35 37.85,30.23 34.04,26.42 v34.04,13.46 | 56.77,30.48 C3.2 | v53.85,20.83 53.85,23.37 54.36,24.13 56.13,24.13 56.64,24.64 IC1.2 56.64,30.35 56.77,30.48 | 56.77,30.48 56.77,31.62 C5.+
  pour Top (isolate 0.813): 46.48,11.18 41.4,6.1 46.48,1.02 46.99,1.02 52.32,6.35 47.5,11.18
  pour Bottom (isolate 0.406): 53.34,24.38 53.34,20.07 58.93,20.07 59.94,21.08 59.94,24.38
5V  (via drill 0.6)  (1 unrouted)
  Top 0.254: R1.1 57.28,45.22
  Top 0.508: 57.28,45.22 J10.1
  Top 0.813: v55.88,13.97 55.85,13.97 R18.2
  Bottom 0.254: 57.48,50.73 57.4,50.8 | 50.37,50.73 50.29,50.8 | 62.94,49.73 62.99,49.78 | 57.25,10.16 57.15,10.16 57.3,10.01
  Bottom 0.508: J10.1 57.28,45.92 D2.C | J11.1 50.67,46.03 D3.C | J12.1 44.07,45.92 D4.C
  Bottom 0.813: 57.4,50.8 61.98,50.8 62.99,49.78 | 50.8,50.8 57.4,50.8 | 50.8,50.8 50.29,50.8 44.7,50.8 44.07,50.16 J12.1 | 62.94,49.73 62.94,39.06 | J11.1 50.67,50.67 50.8,50.8 | J10.1 57.28,50.67 57.4,50.8 | C1.+ 62.89,39.12 62.94,39.06 | 62.94,35.81 62.94,39.06 | 62.94,27.18 62.94,20.27 JP1.1 61.21,19.81 59.44,18.03 56.64,18.03 55.88,17.27 v55.88,13.97 55.88,11.43 57.15,10.16 | 62.94,27.18 62.94,35.81 | D1.C 62.69,36.07 62.94,35.81 | 60.45,27.23 IC1.3 | 60.45,27.23 62.89,27.23 62.94,27.18 | C2.2 60.33,27.36 60.45,27.23
ATCLK  (via drill 0.4)
  Top 0.254: U1.30 40.31,31.83 39.62,32.51 39.62,46.74 37.34,49.02 J3.2 37.34,51.56 36.83,52.07 29.72,52.07 29.46,51.82 J4.3 29.46,50.29 28.7,49.53 28.7,47.5 29.72,46.48 29.72,43.94 29.21,43.43 29.21,41.15 25.91,37.85 25.91,15.49 26.67,14.73 26.67,13.21 v27.18,12.7 | U4.45 41.67,9.65 39.37,9.65 38.1,8.38 30.99,8.38 30.23,9.14 v29.21,9.14
  Bottom 0.254: v29.21,9.14 27.18,11.18 v27.18,12.7
ATCS
  Top 0.254: J3.4 34.8,48.51 38.61,44.7 38.61,30.48 39.8,29.29 U1.28 45.55,29.29 46.48,30.23 54.36,30.23 55.88,28.7 55.88,19.56 55.12,18.8 51.05,18.8 50.8,18.54 50.8,15.24 50.04,14.48 46.48,14.48 44.2,12.19 44.2,11.37 U4.39
ATIO  (via drill 0.4)
  Top 0.254: J4.4 28.19,47.24 29.21,46.23 29.21,44.2 28.7,43.69 28.7,41.4 25.4,38.1 25.4,28.02 | U1.12 25.4,28.02 | U4.46 41.47,9.14 39.62,9.14 38.35,7.87 30.99,7.87 30.48,7.37 v29.21,7.37 | 25.4,28.02 v25.4,13.72
  Bottom 0.254: v25.4,13.72 25.4,12.95 25.91,12.45 25.91,11.94 26.67,11.18 26.67,10.92 27.94,9.65 27.94,8.38 28.96,7.37 v29.21,7.37
ATRESET
  Top 0.254: J4.1 32,49.78 38.1,43.69 38.1,29.46 39.54,28.02 U1.27 45.04,28.02 46.74,29.72 54.1,29.72 55.37,28.45 55.37,19.81 54.86,19.3 50.8,19.3 50.29,18.8 | U4.40 43.69,11.17 43.69,12.45 46.23,14.99 49.78,14.99 50.29,15.49 50.29,18.8 | R17.2 50.29,18.8
D+
  Bottom 0.254: USB1.D+ U2.19
D-
  Bottom 0.254: USB1.D- U2.18
EN  (via drill 0.4)
  Top 0.254: U1.3 21,39.45 20.71,39.74 R2.2 17.66,39.74 16.76,40.64 v16.76,42.16 16.76,43.69 16.13,44.32 S1.3
  Bottom 0.254: IC3.4 14.11,34.4 13.46,35.05 13.46,36.07 14.99,37.59 16,37.59 16.76,38.35 v16.76,42.16
EN_AP  (via drill 0.4)
  Top 0.254: v35.81,18.29 v32.26,18.29
  Bottom 0.254: v32.26,18.29 32.26,19.3 32.51,19.56 32.51,21.84 31.5,22.86 28.96,22.86 28.45,22.35 21.59,22.35 21.08,22.86 21.08,28.19 20.57,28.7 20.57,32 20.32,32.26 19.56,32.26 18.03,33.78 18.03,34.54 17.53,35.05 IC3.2 | v35.81,18.29 37.85,18.29 38.99,17.14 U2.9
GND  (via drill 0.6)
  Top 0.254: U1.GND | 41.94,42.16 U1.38 | U4.5 41.61,2.29 41.4,2.29 41.18,2.06 C9.1 | U4.42 42.93,10.51 42.93,13.32 C13.1 | USERLED.C 49.53,32.51 51.05,30.99 | 48.19,10.95 U4.35 | 48.19,10.95 49.13,11.89 50.73,11.89 51.42,12.57 C10.1 | 55.97,3.3 C14.2 56.71,3.3 57.4,3.3 57.81,2.89 USB2.P$2 | C12.1 51.93,2.17 51.56,2.54 50.19,2.54 U4.18 48.77,3.96 48.77,4.32 50.55,6.1 50.55,6.6 47.54,9.61 47.54,10.38 48.11,10.95 48.19,10.95
  Top 0.61: U3.P$3 10.37,16.47 10.16,16.26
  Top 0.813: C15.2 C14.2
  Bottom 0.254: R12.1 53.46,41.11 | R14.1 49.9,41.11 Q2.2 | R16.1 46.34,41.11 Q3.2 | 57.15,6.96 USB1.GND | IC2.3 15.89,31.35 15.75,31.5 15.75,31.75 15.49,32 13.97,32 13.21,31.24 | IC3.3 16.65,34.4 19.3,31.75 19.3,30.99 v19.56,30.48
  Bottom 0.813: 55.63,5.08 57.15,6.6 57.15,6.96
  other vias: 14.99,39.12 18.8,44.2 37.85,26.42 31.24,40.64 36.32,42.93 41.15,50.8 24.89,50.8 53.34,43.18 49.02,43.18 44.45,43.18 51.56,28.19 29.72,28.45 10.16,37.59 29.21,14.22 40.39,20.57 23.37,46.48 6.86,44.96 27.43,45.21 10.41,30.48 45.97,16 30.73,36.32 32.77,36.32 34.8,36.32 34.8,34.29 32.77,34.29 30.73,34.29 30.73,32.26 32.77,32.26 34.8,32.26
  pour Bottom (isolate 0.61, rank 2): -8.13,60.45 -8.13,-7.11 72.64,-7.11 72.64,60.45
  pour Top (isolate 0.61, rank 2): -5.59,56.9 -5.59,-4.06 68.58,-4.06 68.58,56.9
IO2  (via drill 0.4)
  Top 0.254: R7.2 v17.78,18.29 17.06,17.57 U3.P$2 | 44.51,25.48 R3.2 | R3.2 43.3,25.28 43.1,25.48 U1.25 40.28,23.99 U1.24 38.48,22.23 37.59,21.34 30.73,21.34 v29.97,20.57 | S2.1 46.74,25.65 46.37,25.28 R3.2
  Bottom 0.254: IC2.4 14.9,31.08 15.49,30.48 17.27,30.48 17.53,30.23 17.53,28.7 18.03,28.19 18.8,28.19 19.56,27.43 19.56,20.83 | 19.56,20.83 19.56,20.07 v17.78,18.29 | v29.97,20.57 29.21,20.57 28.96,20.83 19.56,20.83
IO4  (via drill 0.4)
  Top 0.254: U1.26 44.53,26.75 46.23,28.45 v47.75,28.45 | R6.2 17.27,20.32 | 17.27,20.32 v17.27,21.59 | U3.P$1 15.37,18.67 17.02,20.32 17.27,20.32 | v49.02,16.26 48.77,17.02 48.51,17.27 45.97,17.27 45.21,18.03 42.93,18.03 37.08,12.19 37.08,9.65 36.32,8.89 31.5,8.89 29.97,10.41 28.7,10.41 27.94,9.65 27.94,8.89 27.43,8.38 25.4,8.38 v24.64,9.14
  Bottom 0.254: v47.75,28.45 47.75,24.38 48.77,23.37 48.77,16.51 v49.02,16.26 | v17.27,21.59 17.27,21.08 17.02,20.83 16.76,20.83 15.24,19.3 15.24,15.75 16.51,14.48 16.51,13.72 16,13.21 16,10.67 15.75,10.41 15.75,9.91 14.99,9.14 14.99,8.13 15.75,7.37 16.76,7.37 17.53,8.13 23.62,8.13 v24.64,9.14
IO12  (via drill 0.4)
  Top 0.254: U1.14 17.7,25.48 v16.26,26.92 | U3.P$8 15.45,10.97 16.26,10.16 v16.26,8.64
  Bottom 0.254: v16.26,26.92 17.53,25.65 18.29,25.65 18.54,25.4 18.54,20.57 18.29,20.32 17.02,20.32 15.75,19.05 15.75,16 17.02,14.73 17.02,13.46 16.51,12.95 16.51,10.41 16.26,10.16 v16.26,8.64
IO13  (via drill 0.4)
  Top 0.254: R10.2 v17.78,10.16 15.87,12.07 U3.P$7 | U1.16 28.32,22.73 27.43,21.84 v27.43,18.03
  Bottom 0.254: v17.78,10.16 19.05,11.43 19.05,12.7 18.29,13.46 18.29,14.22 19.56,15.49 19.56,18.54 20.83,19.81 26.92,19.81 27.43,19.3 v27.43,18.03
IO14  (via drill 0.4)
  Top 0.254: U3.P$4 16.89,15.37 v17.78,16.26 R8.2 | U1.13 18.46,26.75 v18.29,26.92
  Bottom 0.254: v17.78,16.26 16.76,16.26 16.26,16.76 16.26,18.8 17.27,19.81 18.54,19.81 19.05,20.32 19.05,26.42 18.54,26.92 v18.29,26.92
IO15  (via drill 0.4)
  Top 0.254: R9.2 v17.78,12.19 16.8,13.17 U3.P$6 | U1.23 37.21,22.48 36.58,21.84 29.46,21.84 28.7,21.08 v28.7,19.3
  Bottom 0.254: v17.78,12.19 17.78,14.48 19.05,15.75 19.05,18.8 20.57,20.32 27.69,20.32 v28.7,19.3
N$1
  Top 0.254: U1.31 40.56,33.1 40.13,33.53 40.13,47.75 38.61,49.28 J3.1
N$2
  Top 0.254: R19.1 40.27,8.13 41.07,8.13 U4.48
N$3
  Top 0.254: USERLED.A 44.33,32.51 R5.2
N$4
  Top 0.254: ATLED.A R19.2
N$5
  Top 0.254: J3.3 36.07,48.77 39.12,45.72 39.12,31.5 40.05,30.56 U1.29 43.91,30.56 R5.1
N$6
  Top 0.254: U4.1 41.58,5.08 35.56,5.08 34.54,4.06 J13.4
N$7
  Top 0.254: R1.2 60.09,43.3 PWRLED.A
N$8
  Top 0.254: J13.3 35.81,4.06 36.32,4.57 39.12,4.57 39.88,3.81 41.01,3.81 U4.2
N$9
  Top 0.254: U4.43 41.78,10.95 41.78,11.68 41.78,11.81 41.78,11.99 C13.2
N$10
  Top 0.254: U4.33 49.54,10.92 51.05,10.92 52.58,9.4 54.61,9.4 56.05,7.96 USB2.D-
N$11
  Top 0.254: U4.34 49.34,11.43 51.31,11.43 52.83,9.91 54.86,9.91 56.16,8.61 USB2.D+
N$12
  Top 0.254: USB2.VBUS 56.99,7.21
  Top 0.61: 56.99,7.21 56.63,7.12
  Top 0.813: 56.63,7.12 54.32,7.12 R18.1
N$13
  Top 0.254: U4.3 41.21,3.3 J13.1
N$14
  Top 0.254: U4.4 41.41,2.79 39.88,2.79 39.12,2.03 37.59,2.03 37.08,2.54 J13.2
N$15
  Bottom 0.254: 60.07,46.03 D2.A 59.94,45.29
  Bottom 0.508: Q1.3 58,43.43 59.44,43.43 60.38,44.38 D2.A | J10.2 60.07,46.03
N$16
  Bottom 0.254: 53.47,45.92 D3.A 53.34,45.65 | Q2.3 50.96,43.26
  Bottom 0.508: 50.96,43.26 53.34,45.65 | J11.2 53.47,45.92
N$17
  Bottom 0.254: Q2.1 51.7,41.11 R14.2 R13.1
N$18
  Bottom 0.254: U2.4 41.78,10.79 41.15,11.43 41.15,12.95 40.89,13.21 R4.2
N$20
  Top 0.254: 51.82,5.15 U4.24 Y2.P$1 54.1,5.33 54.36,5.59 56.3,5.59 | 56.3,5.59 C15.1 56.3,5.59
N$21
  Bottom 0.254: R11.1 R12.2 55.26,41.09 Q1.1
N$22
  Bottom 0.254: Y1.P$2 36.34,6.52 C6.1 39.46,6.6 40.39,6.6 42.04,8.26 U2.2
N$23
  Bottom 0.254: U2.3 42.04,9.53 40.39,11.18 39.46,11.18 C7.1 36.34,11.26 Y1.P$1
N$24
  Top 0.254: U1.4 22.43,38.18 20.07,35.81 8.89,35.81 8.38,36.32 8.38,39.12 6.6,40.89 6.6,42.42 5.84,43.18 J1.4
N$25
  Top 0.254: U1.5 22.43,36.91 20.83,35.31 8.38,35.31 7.62,36.07 7.62,38.35 5.33,40.64 J1.3
N$26
  Top 0.254: U1.6 22.18,35.64 21.34,34.8 7.87,34.8 6.86,35.81 6.86,37.34 6.1,38.1 J1.2
N$27
  Top 0.254: U1.7 23.69,34.29 6.86,34.29 5.59,35.56 J1.1
N$28
  Top 0.254: U1.8 22.53,33.1 21.84,33.78 6.86,33.78 5.84,32.77 J2.4
N$29
  Top 0.254: U1.9 22.53,31.83 21.08,33.27 7.87,33.27 6.86,32.26 6.86,30.73 6.35,30.23 J2.3
N$30
  Top 0.254: U1.10 22.53,30.56 20.32,32.77 8.89,32.77 7.62,31.5 7.62,28.19 7.11,27.69 J2.2
N$31
  Top 0.254: U1.11 22.78,29.29 19.81,32.26 9.4,32.26 8.38,31.24 8.38,26.42 7.11,25.15 J2.1
N$32
  Bottom 0.254: 47.24,45.65 D4.A 46.86,46.03
  Bottom 0.508: Q3.3 47.24,45.65 | J12.2 46.86,46.03
N$33
  Bottom 0.254: Q3.1 48.14,41.11 R16.2 R15.1
N$34
  Top 0.254: Y2.P$2 53.67,1.45 | C14.1 56.3,1.27 54.86,1.27 54.68,1.45 Y2.P$2 | U4.23 52.58,3.69 52.58,2.79 53.79,1.59 Y2.P$2
OE_AP  (via drill 0.4)
  Top 0.254: v35.81,15.49 v32.26,15.49
  Bottom 0.254: IC3.1 16.14,35.7 15.75,35.31 15.75,33.78 16.6,32.93 IC2.1 | IC2.1 16.91,32.65 | IC2.1 17.64,32.65 18.54,31.75 18.54,29.46 18.8,29.21 19.3,29.21 20.57,27.94 20.57,22.35 21.08,21.84 28.7,21.84 29.21,22.35 31.24,22.35 32,21.59 32,20.07 30.99,19.05 30.99,17.78 32.26,16.51 v32.26,15.49 | v35.81,15.49 36.7,14.61 U2.7
P_AP  (via drill 0.4)
  Top 0.254: v30.23,16.76 v37.59,16.76
  Bottom 0.254: IC2.2 17.53,32 18.03,31.5 18.03,28.96 18.29,28.7 19.05,28.7 20.07,27.69 20.07,21.84 20.57,21.34 28.96,21.34 29.46,21.84 30.99,21.84 31.5,21.34 31.5,20.32 30.23,19.05 v30.23,16.76 | v37.59,16.76 38.48,15.88 U2.8
PW1  (via drill 0.4)
  Top 0.254: v53.34,34.54 52.83,35.05 51.05,35.05 46.74,39.37 43.69,39.37 43.43,39.62 43.43,40.13 42.85,40.72 U1.37
  Bottom 0.254: R11.2 53.46,34.66 v53.34,34.54
PW2  (via drill 0.4)
  Top 0.254: v49.78,34.54 49.28,35.05 49.28,36.07 46.48,38.86 43.43,38.86 42.93,39.37 41.85,39.37 U1.36
  Bottom 0.254: R13.2 49.9,34.66 v49.78,34.54
PW3  (via drill 0.4)
  Top 0.254: U1.33 45.64,35.64 46.23,35.05 v46.23,34.54
  Bottom 0.254: R15.2 46.34,34.66 v46.23,34.54
RX  (via drill 0.4)
  Top 0.254: U1.34 v43.56,36.91
  Bottom 0.254: 43.41,36.75 v43.56,36.91 43.41,36.75 | U2.10 43.41,36.75
TX  (via drill 0.4)
  Top 0.254: v51.56,33.53 50.55,33.53 50.29,33.27 49.28,33.27 48.51,34.04 48.51,36.07 46.23,38.35 43.43,38.35 43.26,38.18 U1.35
  Bottom 0.254: U2.12 50.42,17.14 49.28,18.29 49.28,23.62 48.26,24.64 48.26,27.18 49.02,27.94 49.02,28.96 48.01,29.97 48.01,32.26 49.02,33.27 51.31,33.27 v51.56,33.53

### Text on the board
tNames: +3.3V Power | Controlled +5V to GND | ESP32-WROOM | + | - | + | - | RESET | GPIO | PROG | SDCARD | EXTPWR | ATLED | ARM / bridge | GND | USB | ATIO
bNames: Misc GPIO | rev 4 | YAE32BB | USB-UART | USB